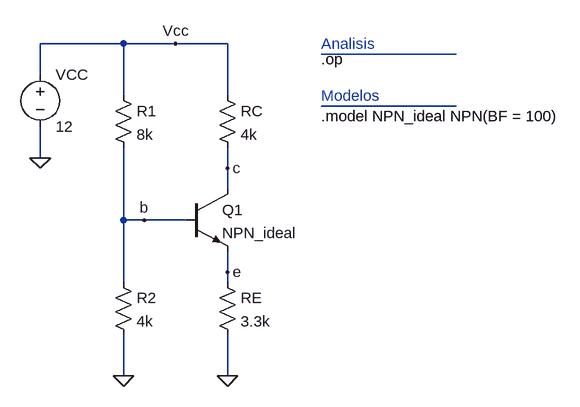
[diagram p0: schematic example1_design2.asc]
example1_design2.asc, the LTspice schematic file:
Version 4
SHEET 1 916 680
WIRE -336 -256 -464 -256
WIRE -256 -256 -336 -256
WIRE -176 -256 -256 -256
WIRE 176 -240 -32 -240
WIRE -464 -208 -464 -256
WIRE -336 -176 -336 -256
WIRE -176 -176 -176 -256
WIRE 176 -160 -32 -160
WIRE -464 -80 -464 -128
WIRE -176 -64 -176 -96
WIRE -176 -32 -176 -64
WIRE -336 16 -336 -96
WIRE -304 16 -336 16
WIRE -240 16 -304 16
WIRE -176 96 -176 64
WIRE -336 112 -336 16
WIRE -176 112 -176 96
WIRE -336 256 -336 192
WIRE -176 256 -176 192
FLAG -464 -80 0
FLAG -336 256 0
FLAG -304 16 b
FLAG -176 -64 c
FLAG -176 96 e
FLAG -176 256 0
FLAG -256 -256 Vcc
SYMBOL npn -240 -32 R0
SYMATTR InstName Q1
SYMATTR Value NPN_ideal
SYMBOL res -352 96 R0
SYMATTR InstName R2
SYMATTR Value 4k
SYMBOL res -192 -192 R0
SYMATTR InstName RC
SYMATTR Value 4k
SYMBOL voltage -464 -224 R0
WINDOW 123 0 0 Left 0
WINDOW 39 0 0 Left 0
SYMATTR InstName VCC
SYMATTR Value 12
SYMBOL res -192 96 R0
SYMATTR InstName RE
SYMATTR Value 3.3k
SYMBOL res -352 -192 R0
SYMATTR InstName R1
SYMATTR Value 8k
TEXT -32 -256 Left 2 ;Analisis
TEXT -32 -232 Left 2 !.op
TEXT -32 -144 Left 2 !.model NPN_ideal NPN(BF = 100)
TEXT -32 -176 Left 2 ;Modelos

The netlist it stands for:
* example1_design2.asc
Q1 c b e 0 NPN_ideal
R2 b 0 4k
RC Vcc c 4k
VCC Vcc 0 12
RE e 0 3.3k
R1 Vcc b 8k
.model NPN NPN
.model PNP PNP
.lib standard.bjt
* Analisis
.op
.model NPN_ideal NPN(BF = 100)
* Modelos
.backanno
.end

* Results of the author's LTspice run, read from the files saved beside the schematic
* Operating Point:
*   V(c) = 8.158 V
*   V(b) = 3.974 V
*   V(e) = 3.201 V
*   V(vcc) = 12 V
*   Ic(Q1) = 960.5 µA
*   Ib(Q1) = 9.605 µA
*   Ie(Q1) = -970.1 µA
*   I(R1) = 1.003 mA
*   I(Re) = 970.1 µA
*   I(Rc) = 960.5 µA
*   I(R2) = 993.6 µA
*   I(Vcc) = -1.964 mA
* From the log:
*   Semiconductor Device Operating Points:
*                           --- Bipolar Transistors ---
*   Name:       q1
*   Model:   npn_ideal
*   Ib:       9.60e-06
*   Ic:       9.60e-04
*   Vbe:      7.73e-01
*   Vbc:     -4.18e+00
*   Vce:      4.96e+00
*   BetaDC:   1.00e+02
*   Gm:       3.71e-02
*   Rpi:      2.69e+03
*   Rx:       0.00e+00
*   Ro:       4.59e+84
*   Cbe:      0.00e+00
*   Cbc:      0.00e+00
*   Cjs:      0.00e+00
*   BetaAC:   1.00e+02
*   Cbx:      0.00e+00
*   Ft:       0.00e+00